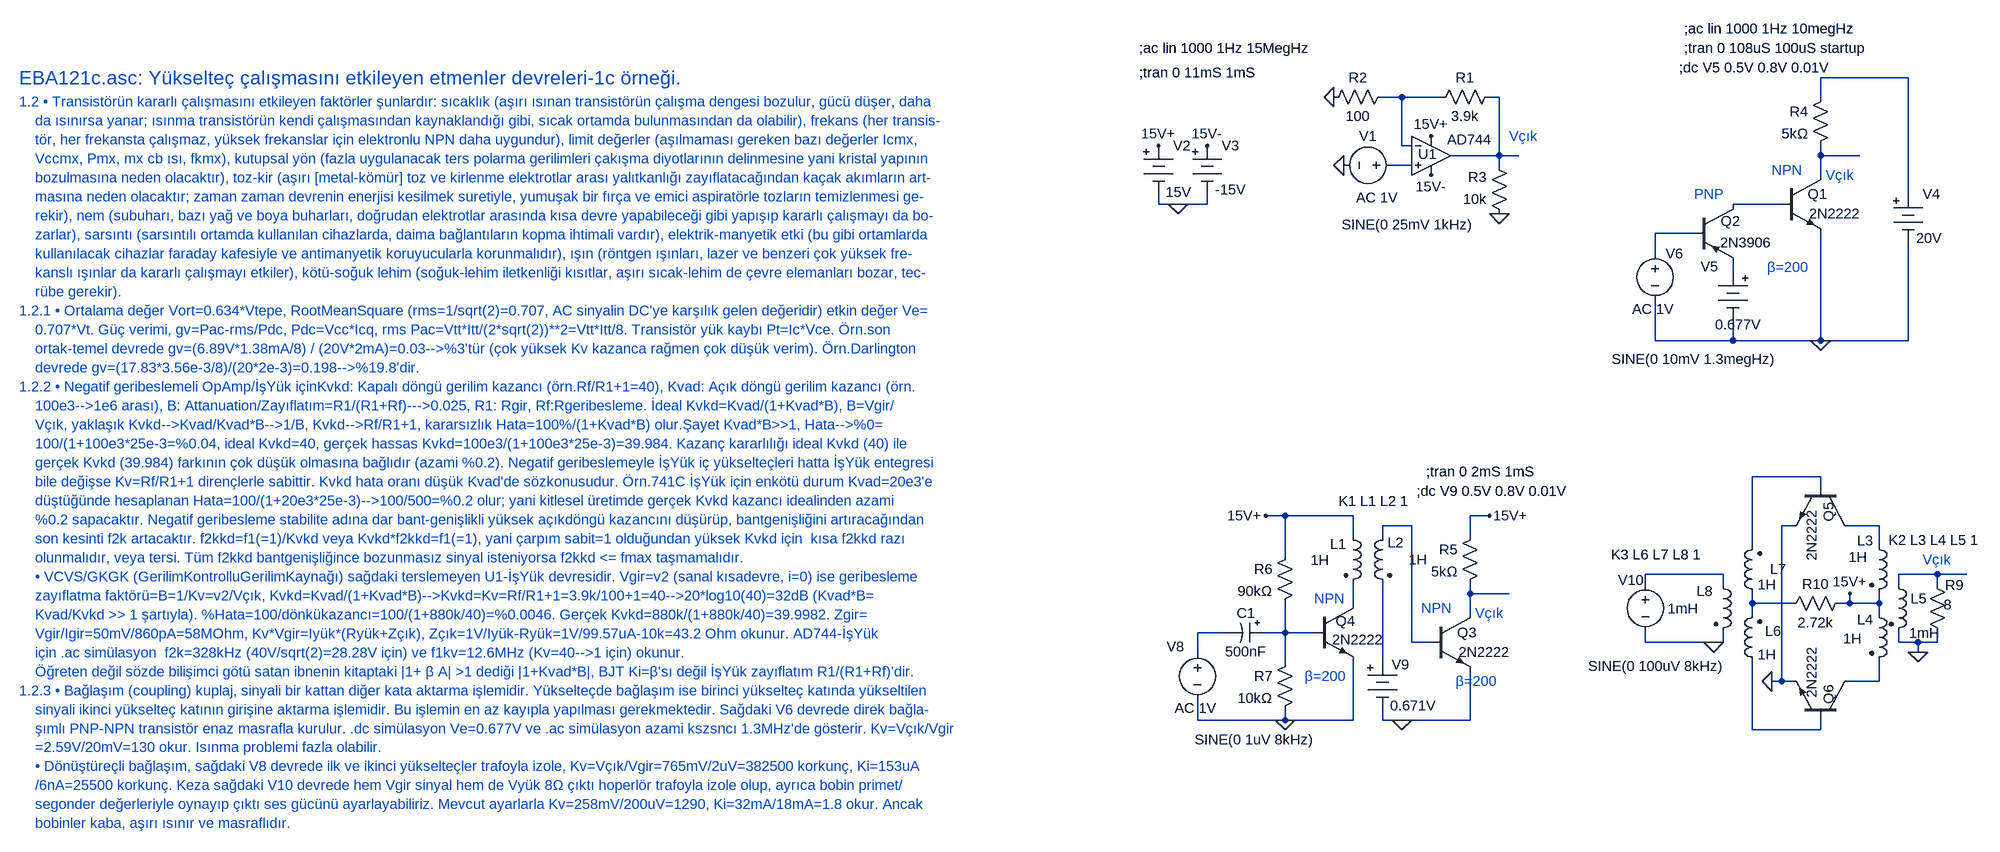
[diagram p0: schematic EBA121c.asc]
EBA121c.asc, the LTspice schematic file:
Version 4
SHEET 1 4648 4332
WIRE 2880 48 2736 48
WIRE 2048 80 2016 80
WIRE 2112 80 2048 80
WIRE 2208 80 2192 80
WIRE 2736 80 2736 48
WIRE 2048 160 2048 80
WIRE 2064 160 2048 160
WIRE 2208 176 2208 80
WIRE 2208 176 2128 176
WIRE 2240 176 2208 176
WIRE 2736 176 2736 160
WIRE 2800 176 2736 176
WIRE 2064 192 2032 192
WIRE 2208 192 2208 176
WIRE 2736 208 2736 176
WIRE 2880 240 2880 48
WIRE 1648 256 1648 240
WIRE 1680 256 1648 256
WIRE 1728 256 1728 240
WIRE 1728 256 1680 256
WIRE 2672 256 2592 256
WIRE 2528 304 2464 304
WIRE 2464 336 2464 304
WIRE 2592 368 2592 352
WIRE 2464 480 2464 416
WIRE 2592 480 2592 448
WIRE 2592 480 2464 480
WIRE 2736 480 2736 304
WIRE 2736 480 2592 480
WIRE 2880 480 2880 320
WIRE 2880 480 2736 480
WIRE 2736 704 2624 704
WIRE 2736 720 2736 704
WIRE 1856 768 1824 768
WIRE 1968 768 1856 768
WIRE 2192 768 2160 768
WIRE 2064 784 2016 784
WIRE 2688 784 2672 784
WIRE 2832 784 2784 784
WIRE 1968 800 1968 768
WIRE 2016 800 2016 784
WIRE 2160 800 2160 768
WIRE 2624 816 2624 704
WIRE 2832 816 2832 784
WIRE 1856 832 1856 768
WIRE 2576 864 2448 864
WIRE 2928 864 2864 864
WIRE 2976 864 2928 864
WIRE 2448 880 2448 864
WIRE 2576 880 2576 864
WIRE 2864 880 2864 864
WIRE 2928 880 2928 864
WIRE 2160 896 2160 880
WIRE 2224 896 2160 896
WIRE 1968 912 1968 880
WIRE 2624 912 2624 896
WIRE 2688 912 2624 912
WIRE 2784 912 2784 896
WIRE 2784 912 2768 912
WIRE 2832 912 2832 896
WIRE 2832 912 2784 912
WIRE 2160 928 2160 896
WIRE 2624 928 2624 912
WIRE 2832 928 2832 912
WIRE 1760 960 1712 960
WIRE 1856 960 1856 912
WIRE 1856 960 1824 960
WIRE 1904 960 1856 960
WIRE 2064 976 2064 784
WIRE 2096 976 2064 976
WIRE 2448 976 2448 960
WIRE 2560 976 2448 976
WIRE 2576 976 2576 960
WIRE 2576 976 2560 976
WIRE 2864 976 2864 960
WIRE 2896 976 2864 976
WIRE 2928 976 2928 960
WIRE 2928 976 2896 976
WIRE 1712 992 1712 960
WIRE 2896 992 2896 976
WIRE 1856 1008 1856 960
WIRE 2016 1008 2016 880
WIRE 2672 1040 2672 784
WIRE 2672 1040 2656 1040
WIRE 2688 1040 2672 1040
WIRE 2832 1040 2832 1008
WIRE 2832 1040 2784 1040
WIRE 1712 1104 1712 1072
WIRE 1856 1104 1856 1088
WIRE 1856 1104 1712 1104
WIRE 1968 1104 1968 1008
WIRE 1968 1104 1856 1104
WIRE 2016 1104 2016 1088
WIRE 2048 1104 2016 1104
WIRE 2160 1104 2160 1024
WIRE 2160 1104 2048 1104
WIRE 2624 1120 2624 1008
WIRE 2736 1120 2736 1104
WIRE 2736 1120 2624 1120
FLAG 2096 144 15V+
FLAG 2096 208 15V-
FLAG 1952 192 0
FLAG 1936 80 0
FLAG 2208 272 0
FLAG 1648 160 15V+
FLAG 1728 160 15V-
FLAG 1680 256 0
FLAG 2736 480 0
FLAG 2048 1104 0
FLAG 1856 1104 0
FLAG 2896 992 0
FLAG 2784 896 15V+
FLAG 2560 976 0
FLAG 2656 1040 0
FLAG 1824 768 15V+
FLAG 2192 768 15V+
SYMBOL OpAmps\\AD744 2096 112 R0
WINDOW 0 -21 62 Left 2
WINDOW 3 26 38 Left 2
SYMATTR InstName U1
SYMBOL voltage 2048 192 R90
WINDOW 0 -32 56 VBottom 2
WINDOW 3 82 -9 VTop 2
WINDOW 123 38 41 VTop 2
WINDOW 39 0 0 Left 0
SYMATTR InstName V1
SYMATTR Value SINE(0 25mV 1kHz)
SYMATTR Value2 AC 1V
SYMBOL res 2208 64 R90
WINDOW 0 0 56 VBottom 2
WINDOW 3 32 56 VTop 2
SYMATTR InstName R1
SYMATTR Value 3.9k
SYMBOL res 2032 64 R90
WINDOW 0 0 56 VBottom 2
WINDOW 3 32 56 VTop 2
SYMATTR InstName R2
SYMATTR Value 100
SYMBOL res 2224 288 R180
WINDOW 0 36 76 Left 2
WINDOW 3 36 40 Left 2
SYMATTR InstName R3
SYMATTR Value 10k
SYMBOL Misc\\battery 1648 144 R0
WINDOW 3 12 92 Left 2
SYMATTR Value 15V
SYMATTR InstName V2
SYMBOL Misc\\battery 1728 144 R0
WINDOW 3 13 88 Left 2
SYMATTR Value -15V
SYMATTR InstName V3
SYMBOL npn 2672 208 R0
WINDOW 0 43 32 Left 2
WINDOW 3 45 64 Left 2
SYMATTR InstName Q1
SYMATTR Value 2N2222
SYMBOL pnp 2528 256 R0
WINDOW 0 44 28 Left 2
WINDOW 3 43 63 Left 2
SYMATTR InstName Q2
SYMATTR Value 2N3906
SYMBOL res 2752 64 M0
SYMATTR InstName R4
SYMATTR Value 5kΩ
SYMBOL Misc\\battery 2880 224 R0
WINDOW 3 13 88 Left 2
SYMATTR Value 20V
SYMATTR InstName V4
SYMBOL Misc\\battery 2592 352 M0
WINDOW 3 -47 102 Left 2
WINDOW 0 24 7 Left 2
SYMATTR Value 0.677V
SYMATTR InstName V5
SYMBOL voltage 2464 320 M0
WINDOW 0 -32 2 Top 2
WINDOW 3 -65 206 Bottom 2
WINDOW 123 3 124 Bottom 2
WINDOW 39 0 0 Left 0
SYMATTR InstName V6
SYMATTR Value SINE(0 10mV 1.3megHz)
SYMATTR Value2 AC 1V
SYMBOL npn 2096 928 R0
WINDOW 0 43 32 Left 2
WINDOW 3 45 64 Left 2
SYMATTR InstName Q3
SYMATTR Value 2N2222
SYMBOL res 2176 784 M0
SYMATTR InstName R5
SYMATTR Value 5kΩ
SYMBOL ind2 1952 784 R0
WINDOW 0 -22 31 Left 2
WINDOW 3 -54 57 Left 2
SYMATTR InstName L1
SYMATTR Value 1H
SYMATTR Type ind
SYMBOL ind2 2032 784 M0
WINDOW 0 -20 28 Left 2
WINDOW 3 -58 56 Left 2
SYMATTR InstName L2
SYMATTR Value 1H
SYMATTR Type ind
SYMBOL npn 1904 912 R0
WINDOW 0 35 29 Left 2
WINDOW 3 29 60 Left 2
SYMATTR InstName Q4
SYMATTR Value 2N2222
SYMBOL res 1872 816 M0
SYMATTR InstName R6
SYMATTR Value 90kΩ
SYMBOL res 1872 992 M0
SYMATTR InstName R7
SYMATTR Value 10kΩ
SYMBOL voltage 1712 976 M0
WINDOW 0 36 -8 Top 2
WINDOW 3 -94 176 Bottom 2
WINDOW 123 3 124 Bottom 2
WINDOW 39 0 0 Left 0
SYMATTR InstName V8
SYMATTR Value SINE(0 1uV 8kHz)
SYMATTR Value2 AC 1V
SYMBOL Misc\\battery 2016 992 R0
WINDOW 3 13 88 Left 2
WINDOW 0 15 21 Left 2
SYMATTR Value 0.671V
SYMATTR InstName V9
SYMBOL npn 2784 720 R90
WINDOW 0 26 34 Left 2
WINDOW 3 37 62 Left 2
SYMATTR InstName Q5
SYMATTR Value 2N2222
SYMBOL npn 2784 1104 M270
WINDOW 0 26 34 Left 2
WINDOW 3 37 62 Left 2
SYMATTR InstName Q6
SYMATTR Value 2N2222
SYMBOL ind2 2816 800 R0
WINDOW 0 -20 9 Left 2
WINDOW 3 -34 36 Left 2
SYMATTR InstName L3
SYMATTR Value 1H
SYMATTR Type ind
SYMBOL ind2 2816 912 R0
WINDOW 0 -20 27 Left 2
WINDOW 3 -43 58 Left 2
SYMATTR InstName L4
SYMATTR Value 1H
SYMATTR Type ind
SYMBOL ind2 2848 864 R0
WINDOW 3 34 97 Left 2
SYMATTR Value 1mH
SYMATTR InstName L5
SYMATTR Type ind
SYMBOL res 2912 864 R0
WINDOW 0 29 18 Left 2
WINDOW 3 26 50 Left 2
SYMATTR InstName R9
SYMATTR Value 8
SYMBOL ind2 2640 1024 R180
WINDOW 0 -32 66 Left 2
WINDOW 3 -23 28 Left 2
SYMATTR InstName L6
SYMATTR Value 1H
SYMATTR Type ind
SYMBOL ind2 2640 912 R180
WINDOW 0 -40 56 Left 2
WINDOW 3 -23 31 Left 2
SYMATTR InstName L7
SYMATTR Value 1H
SYMATTR Type ind
SYMBOL ind2 2560 864 R0
WINDOW 0 -28 28 Left 2
WINDOW 3 -75 57 Left 2
SYMATTR InstName L8
SYMATTR Value 1mH
SYMATTR Type ind
SYMATTR SpiceLine Rser=1m
SYMBOL res 2784 896 R90
WINDOW 0 0 56 VBottom 2
WINDOW 3 32 56 VTop 2
SYMATTR InstName R10
SYMATTR Value 2.72k
SYMBOL voltage 2448 864 R0
WINDOW 0 -45 10 Left 2
WINDOW 3 -94 151 Left 2
WINDOW 123 0 0 Left 0
WINDOW 39 0 0 Left 0
SYMATTR InstName V10
SYMATTR Value SINE(0 100uV 8kHz)
SYMBOL polcap 1824 944 R90
WINDOW 0 0 32 VBottom 2
WINDOW 3 32 32 VTop 2
SYMATTR InstName C1
SYMATTR Value 500nF
TEXT -224 48 Left 3 ;EBA121c.asc: Yükselteç çalışmasını etkileyen etmenler devreleri-1c örneği.
TEXT -224 88 Left 2 ;1.2 • Transistörün kararlı çalışmasını etkileyen faktörler şunlardır: sıcaklık (aşırı ısınan transistörün çalışma dengesi bozulur, gücü düşer, daha\n    da ısınırsa yanar; ısınma transistörün kendi çalışmasından kaynaklandığı gibi, sıcak ortamda bulunmasından da olabilir), frekans (her transis-\n    tör, her frekansta çalışmaz, yüksek frekanslar için elektronlu NPN daha uygundur), limit değerler (aşılmaması gereken bazı değerler Icmx,\n    Vccmx, Pmx, mx cb ısı, fkmx), kutupsal yön (fazla uygulanacak ters polarma gerilimleri çakışma diyotlarının delinmesine yani kristal yapının\n    bozulmasına neden olacaktır), toz-kir (aşırı [metal-kömür] toz ve kirlenme elektrotlar arası yalıtkanlığı zayıflatacağından kaçak akımların art-\n    masına neden olacaktır; zaman zaman devrenin enerjisi kesilmek suretiyle, yumuşak bir fırça ve emici aspiratörle tozların temizlenmesi ge-\n    rekir), nem (subuharı, bazı yağ ve boya buharları, doğrudan elektrotlar arasında kısa devre yapabileceği gibi yapışıp kararlı çalışmayı da bo-\n    zarlar), sarsıntı (sarsıntılı ortamda kullanılan cihazlarda, daima bağlantıların kopma ihtimali vardır), elektrik-manyetik etki (bu gibi ortamlarda\n    kullanılacak cihazlar faraday kafesiyle ve antimanyetik koruyucularla korunmalıdır), ışın (röntgen ışınları, lazer ve benzeri çok yüksek fre-\n    kanslı ışınlar da kararlı çalışmayı etkiler), kötü-soğuk lehim (soğuk-lehim iletkenliği kısıtlar, aşırı sıcak-lehim de çevre elemanları bozar, tec-\n    rübe gerekir).\n1.2.1 • Ortalama değer Vort=0.634*Vtepe, RootMeanSquare (rms=1/sqrt(2)=0.707, AC sinyalin DC'ye karşılık gelen değeridir) etkin değer Ve=\n    0.707*Vt. Güç verimi, gv=Pac-rms/Pdc, Pdc=Vcc*Icq, rms Pac=Vtt*Itt/(2*sqrt(2))**2=Vtt*Itt/8. Transistör yük kaybı Pt=Ic*Vce. Örn.son\n    ortak-temel devrede gv=(6.89V*1.38mA/8) / (20V*2mA)=0.03-->%3'tür (çok yüksek Kv kazanca rağmen çok düşük verim). Örn.Darlington\n    devrede gv=(17.83*3.56e-3/8)/(20*2e-3)=0.198-->%19.8'dir.\n1.2.2 • Negatif geribeslemeli OpAmp/İşYük içinKvkd: Kapalı döngü gerilim kazancı (örn.Rf/R1+1=40), Kvad: Açık döngü gerilim kazancı (örn.\n    100e3-->1e6 arası), B: Attanuation/Zayıflatım=R1/(R1+Rf)--->0.025, R1: Rgir, Rf:Rgeribesleme. İdeal Kvkd=Kvad/(1+Kvad*B), B=Vgir/\n    Vçık, yaklaşık Kvkd-->Kvad/Kvad*B-->1/B, Kvkd-->Rf/R1+1, kararsızlık Hata=100%/(1+Kvad*B) olur.Şayet Kvad*B>>1, Hata-->%0=\n    100/(1+100e3*25e-3=%0.04, ideal Kvkd=40, gerçek hassas Kvkd=100e3/(1+100e3*25e-3)=39.984. Kazanç kararlılığı ideal Kvkd (40) ile \n    gerçek Kvkd (39.984) farkının çok düşük olmasına bağlıdır (azami %0.2). Negatif geribeslemeyle İşYük iç yükselteçleri hatta İşYük entegresi\n    bile değişse Kv=Rf/R1+1 dirençlerle sabittir. Kvkd hata oranı düşük Kvad'de sözkonusudur. Örn.741C İşYük için enkötü durum Kvad=20e3'e\n    düştüğünde hesaplanan Hata=100/(1+20e3*25e-3)-->100/500=%0.2 olur; yani kitlesel üretimde gerçek Kvkd kazancı idealinden azami\n    %0.2 sapacaktır. Negatif geribesleme stabilite adına dar bant-genişlikli yüksek açıkdöngü kazancını düşürüp, bantgenişliğini artıracağından \n    son kesinti f2k artacaktır. f2kkd=f1(=1)/Kvkd veya Kvkd*f2kkd=f1(=1), yani çarpım sabit=1 olduğundan yüksek Kvkd için  kısa f2kkd razı \n    olunmalıdır, veya tersi. Tüm f2kkd bantgenişliğince bozunmasız sinyal isteniyorsa f2kkd <= fmax taşmamalıdır.\n    • VCVS/GKGK (GerilimKontrolluGerilimKaynağı) sağdaki terslemeyen U1-İşYük devresidir. Vgir=v2 (sanal kısadevre, i=0) ise geribesleme\n    zayıflatma faktörü=B=1/Kv=v2/Vçık, Kvkd=Kvad/(1+Kvad*B)-->Kvkd=Kv=Rf/R1+1=3.9k/100+1=40-->20*log10(40)=32dB (Kvad*B=\n    Kvad/Kvkd >> 1 şartıyla). %Hata=100/dönkükazancı=100/(1+880k/40)=%0.0046. Gerçek Kvkd=880k/(1+880k/40)=39.9982. Zgir=\n    Vgir/Igir=50mV/860pA=58MOhm, Kv*Vgir=Iyük*(Ryük+Zçık), Zçık=1V/Iyük-Ryük=1V/99.57uA-10k=43.2 Ohm okunur. AD744-İşYük\n    için .ac simülasyon  f2k=328kHz (40V/sqrt(2)=28.28V için) ve f1kv=12.6MHz (Kv=40-->1 için) okunur.\n    Öğreten değil sözde bilişimci götü satan ibnenin kitaptaki |1+ β A| >1 dediği |1+Kvad*B|, BJT Ki=β'sı değil İşYük zayıflatım R1/(R1+Rf)'dir.\n1.2.3 • Bağlaşım (coupling) kuplaj, sinyali bir kattan diğer kata aktarma işlemidir. Yükselteçde bağlaşım ise birinci yükselteç katında yükseltilen\n    sinyali ikinci yükselteç katının girişine aktarma işlemidir. Bu işlemin en az kayıpla yapılması gerekmektedir. Sağdaki V6 devrede direk bağla-\n    şımlı PNP-NPN transistör enaz masrafla kurulur. .dc simülasyon Ve=0.677V ve .ac simülasyon azami kszsncı 1.3MHz'de gösterir. Kv=Vçık/Vgir\n    =2.59V/20mV=130 okur. Isınma problemi fazla olabilir.\n    • Dönüştüreçli bağlaşım, sağdaki V8 devrede ilk ve ikinci yükselteçler trafoyla izole, Kv=Vçık/Vgir=765mV/2uV=382500 korkunç, Ki=153uA\n    /6nA=25500 korkunç. Keza sağdaki V10 devrede hem Vgir sinyal hem de Vyük 8Ω çıktı hoperlör trafoyla izole olup, ayrıca bobin primet/\n    segonder değerleriyle oynayıp çıktı ses gücünü ayarlayabiliriz. Mevcut ayarlarla Kv=258mV/200uV=1290, Ki=32mA/18mA=1.8 okur. Ancak\n    bobinler kaba, aşırı ısınır ve masraflıdır.
TEXT 2224 144 Left 2 ;Vçık
TEXT 1616 40 Left 2 !;tran 0 11mS 1mS
TEXT 1616 0 Left 2 !;ac lin 1000 1Hz 15MegHz
TEXT 2648 360 Left 2 ;β=200
TEXT 2744 208 Left 2 ;Vçık
TEXT 2504 32 Left 2 !;dc V5 0.5V 0.8V 0.01V
TEXT 2512 0 Left 2 !;tran 0 108uS 100uS startup
TEXT 2512 -32 Left 2 !;ac lin 1000 1Hz 10megHz
TEXT 2656 200 Left 2 ;NPN
TEXT 2528 240 Left 2 ;PNP
TEXT 2136 1040 Left 2 ;β=200
TEXT 2168 928 Left 2 ;Vçık
TEXT 2080 920 Left 2 ;NPN
TEXT 1944 744 Left 2 !K1 L1 L2 1
TEXT 1904 904 Left 2 ;NPN
TEXT 1888 1032 Left 2 ;β=200
TEXT 2072 728 Left 2 !;dc V9 0.5V 0.8V 0.01V
TEXT 2848 808 Left 2 !K2 L3 L4 L5 1
TEXT 2392 832 Left 2 !K3 L6 L7 L8 1
TEXT 2088 696 Left 2 !;tran 0 2mS 1mS
TEXT 2904 840 Left 2 ;Vçık

The netlist it stands for:
* EBA121c.asc
XU1 N005 N002 15V+ 15V- N003 AD744  ; pins In+ In- V+ V- OUT
V1 N005 0 SINE(0 25mV 1kHz) AC 1V
R1 N003 N002 3.9k
R2 N002 0 100
R3 0 N003 10k
V2 15V+ 0 15V
V3 15V- 0 -15V
Q1 N004 N006 0 0 2N2222
Q2 N006 N007 N008 0 2N3906
R4 N001 N004 5kΩ
V4 N001 0 20V
V5 N008 0 0.677V
V6 N007 0 SINE(0 10mV 1.3megHz) AC 1V
Q3 N014 N010 0 0 2N2222
R5 15V+ N014 5kΩ
L1 15V+ N015 1H
L2 N010 N019 1H
Q4 N015 N018 0 0 2N2222
R6 15V+ N018 90kΩ
R7 N018 0 10kΩ
V8 N017 0 SINE(0 1uV 8kHz) AC 1V
V9 N019 0 0.671V
Q5 N011 N009 0 0 2N2222
Q6 N020 N021 0 0 2N2222
L3 N011 15V+ 1H
L4 15V+ N020 1H
L5 N013 0 1mH
R9 N013 0 8
L6 N021 N016 1H
L7 N016 N009 1H
L8 N012 0 1mH Rser=1m
R10 15V+ N016 2.72k
V10 N012 0 SINE(0 100uV 8kHz)
C1 N018 N017 500nF
.model NPN NPN
.model PNP PNP
.lib standard.bjt
* EBA121c.asc: Yükselteç çalışmasını etkileyen etmenler devreleri-1c örneği.
* 1.2 • Transistörün kararlı çalışmasını etkileyen faktörler şunlardır: sıcaklık (aşırı ısınan transistörün çalışma dengesi bozulur, gücü düşer, daha
*     da ısınırsa yanar; ısınma transistörün kendi çalışmasından kaynaklandığı gibi, sıcak ortamda bulunmasından da olabilir), frekans (her transis-
*     tör, her frekansta çalışmaz, yüksek frekanslar için elektronlu NPN daha uygundur), limit değerler (aşılmaması gereken bazı değerler Icmx,
*     Vccmx, Pmx, mx cb ısı, fkmx), kutupsal yön (fazla uygulanacak ters polarma gerilimleri çakışma diyotlarının delinmesine yani kristal yapının
*     bozulmasına neden olacaktır), toz-kir (aşırı [metal-kömür] toz ve kirlenme elektrotlar arası yalıtkanlığı zayıflatacağından kaçak akımların art-
*     masına neden olacaktır; zaman zaman devrenin enerjisi kesilmek suretiyle, yumuşak bir fırça ve emici aspiratörle tozların temizlenmesi ge-
*     rekir), nem (subuharı, bazı yağ ve boya buharları, doğrudan elektrotlar arasında kısa devre yapabileceği gibi yapışıp kararlı çalışmayı da bo-
*     zarlar), sarsıntı (sarsıntılı ortamda kullanılan cihazlarda, daima bağlantıların kopma ihtimali vardır), elektrik-manyetik etki (bu gibi ortamlarda
*     kullanılacak cihazlar faraday kafesiyle ve antimanyetik koruyucularla korunmalıdır), ışın (röntgen ışınları, lazer ve benzeri çok yüksek fre-
*     kanslı ışınlar da kararlı çalışmayı etkiler), kötü-soğuk lehim (soğuk-lehim iletkenliği kısıtlar, aşırı sıcak-lehim de çevre elemanları bozar, tec-
*     rübe gerekir).
* 1.2.1 • Ortalama değer Vort=0.634*Vtepe, RootMeanSquare (rms=1/sqrt(2)=0.707, AC sinyalin DC'ye karşılık gelen değeridir) etkin değer Ve=
*     0.707*Vt. Güç verimi, gv=Pac-rms/Pdc, Pdc=Vcc*Icq, rms Pac=Vtt*Itt/(2*sqrt(2))**2=Vtt*Itt/8. Transistör yük kaybı Pt=Ic*Vce. Örn.son
*     ortak-temel devrede gv=(6.89V*1.38mA/8) / (20V*2mA)=0.03-->%3'tür (çok yüksek Kv kazanca rağmen çok düşük verim). Örn.Darlington
*     devrede gv=(17.83*3.56e-3/8)/(20*2e-3)=0.198-->%19.8'dir.
* 1.2.2 • Negatif geribeslemeli OpAmp/İşYük içinKvkd: Kapalı döngü gerilim kazancı (örn.Rf/R1+1=40), Kvad: Açık döngü gerilim kazancı (örn.
*     100e3-->1e6 arası), B: Attanuation/Zayıflatım=R1/(R1+Rf)--->0.025, R1: Rgir, Rf:Rgeribesleme. İdeal Kvkd=Kvad/(1+Kvad*B), B=Vgir/
*     Vçık, yaklaşık Kvkd-->Kvad/Kvad*B-->1/B, Kvkd-->Rf/R1+1, kararsızlık Hata=100%/(1+Kvad*B) olur.Şayet Kvad*B>>1, Hata-->%0=
*     100/(1+100e3*25e-3=%0.04, ideal Kvkd=40, gerçek hassas Kvkd=100e3/(1+100e3*25e-3)=39.984. Kazanç kararlılığı ideal Kvkd (40) ile
*     gerçek Kvkd (39.984) farkının çok düşük olmasına bağlıdır (azami %0.2). Negatif geribeslemeyle İşYük iç yükselteçleri hatta İşYük entegresi
*     bile değişse Kv=Rf/R1+1 dirençlerle sabittir. Kvkd hata oranı düşük Kvad'de sözkonusudur. Örn.741C İşYük için enkötü durum Kvad=20e3'e
*     düştüğünde hesaplanan Hata=100/(1+20e3*25e-3)-->100/500=%0.2 olur; yani kitlesel üretimde gerçek Kvkd kazancı idealinden azami
*     %0.2 sapacaktır. Negatif geribesleme stabilite adına dar bant-genişlikli yüksek açıkdöngü kazancını düşürüp, bantgenişliğini artıracağından
*     son kesinti f2k artacaktır. f2kkd=f1(=1)/Kvkd veya Kvkd*f2kkd=f1(=1), yani çarpım sabit=1 olduğundan yüksek Kvkd için  kısa f2kkd razı
*     olunmalıdır, veya tersi. Tüm f2kkd bantgenişliğince bozunmasız sinyal isteniyorsa f2kkd <= fmax taşmamalıdır.
*     • VCVS/GKGK (GerilimKontrolluGerilimKaynağı) sağdaki terslemeyen U1-İşYük devresidir. Vgir=v2 (sanal kısadevre, i=0) ise geribesleme
*     zayıflatma faktörü=B=1/Kv=v2/Vçık, Kvkd=Kvad/(1+Kvad*B)-->Kvkd=Kv=Rf/R1+1=3.9k/100+1=40-->20*log10(40)=32dB (Kvad*B=
*     Kvad/Kvkd >> 1 şartıyla). %Hata=100/dönkükazancı=100/(1+880k/40)=%0.0046. Gerçek Kvkd=880k/(1+880k/40)=39.9982. Zgir=
*     Vgir/Igir=50mV/860pA=58MOhm, Kv*Vgir=Iyük*(Ryük+Zçık), Zçık=1V/Iyük-Ryük=1V/99.57uA-10k=43.2 Ohm okunur. AD744-İşYük
*     için .ac simülasyon  f2k=328kHz (40V/sqrt(2)=28.28V için) ve f1kv=12.6MHz (Kv=40-->1 için) okunur.
*     Öğreten değil sözde bilişimci götü satan ibnenin kitaptaki |1+ β A| >1 dediği |1+Kvad*B|, BJT Ki=β'sı değil İşYük zayıflatım R1/(R1+Rf)'dir.
* 1.2.3 • Bağlaşım (coupling) kuplaj, sinyali bir kattan diğer kata aktarma işlemidir. Yükselteçde bağlaşım ise birinci yükselteç katında yükseltilen
*     sinyali ikinci yükselteç katının girişine aktarma işlemidir. Bu işlemin en az kayıpla yapılması gerekmektedir. Sağdaki V6 devrede direk bağla-
*     şımlı PNP-NPN transistör enaz masrafla kurulur. .dc simülasyon Ve=0.677V ve .ac simülasyon azami kszsncı 1.3MHz'de gösterir. Kv=Vçık/Vgir
*     =2.59V/20mV=130 okur. Isınma problemi fazla olabilir.
*     • Dönüştüreçli bağlaşım, sağdaki V8 devrede ilk ve ikinci yükselteçler trafoyla izole, Kv=Vçık/Vgir=765mV/2uV=382500 korkunç, Ki=153uA
*     /6nA=25500 korkunç. Keza sağdaki V10 devrede hem Vgir sinyal hem de Vyük 8Ω çıktı hoperlör trafoyla izole olup, ayrıca bobin primet/
*     segonder değerleriyle oynayıp çıktı ses gücünü ayarlayabiliriz. Mevcut ayarlarla Kv=258mV/200uV=1290, Ki=32mA/18mA=1.8 okur. Ancak
*     bobinler kaba, aşırı ısınır ve masraflıdır.
* Vçık
;tran 0 11mS 1mS
;ac lin 1000 1Hz 15MegHz
* β=200
* Vçık
;dc V5 0.5V 0.8V 0.01V
;tran 0 108uS 100uS startup
;ac lin 1000 1Hz 10megHz
* NPN
* PNP
* β=200
* Vçık
* NPN
K1 L1 L2 1
* NPN
* β=200
;dc V9 0.5V 0.8V 0.01V
K2 L3 L4 L5 1
K3 L6 L7 L8 1
;tran 0 2mS 1mS
* Vçık
.backanno
.end